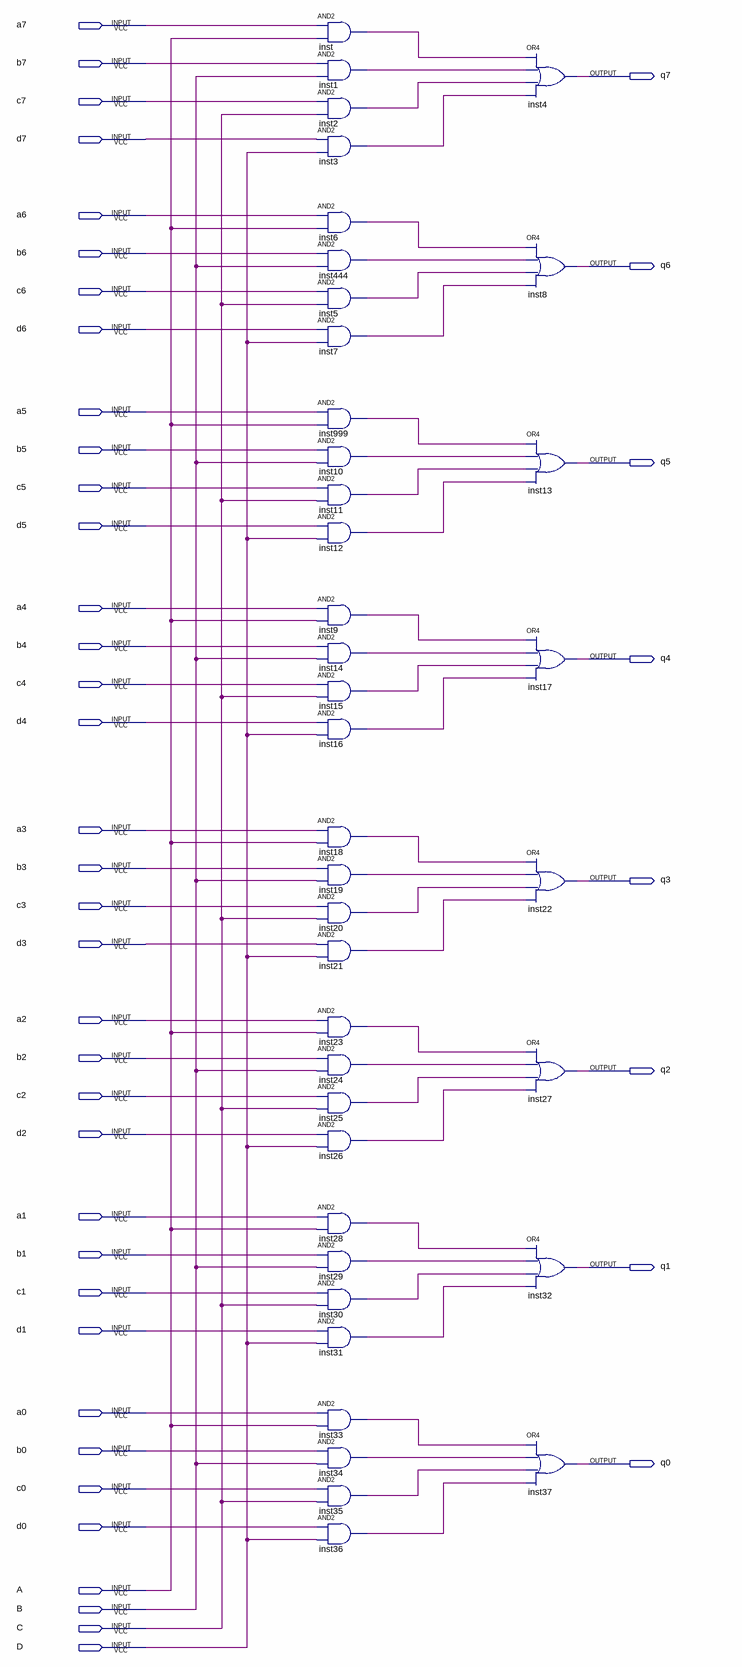
[diagram p0: schematic sheet]
// Quartus schematic choose.bdf as structural Verilog: 40 symbols, 44 pins
module choose (
  input  a7,
  input  b7,
  input  c7,
  input  d7,
  input  a6,
  input  b6,
  input  c6,
  input  d6,
  input  a5,
  input  b5,
  input  c5,
  input  d5,
  input  a4,
  input  b4,
  input  c4,
  input  d4,
  input  a3,
  input  b3,
  input  c3,
  input  d3,
  input  a2,
  input  b2,
  input  c2,
  input  d2,
  input  a1,
  input  b1,
  input  c1,
  input  d1,
  input  a0,
  input  b0,
  input  c0,
  input  d0,
  input  A,
  input  B,
  input  C,
  input  D,
  output q7,
  output q6,
  output q5,
  output q4,
  output q3,
  output q2,
  output q1,
  output q0
);

  wire inst1_out, inst2_out, inst3_out, inst5_out, inst6_out, inst7_out, inst9_out, inst10_out, inst11_out,
       inst12_out, inst14_out, inst15_out, inst16_out, inst18_out, inst19_out, inst20_out, inst21_out,
       inst23_out, inst24_out, inst25_out, inst26_out, inst28_out, inst29_out, inst30_out, inst31_out,
       inst33_out, inst34_out, inst35_out, inst36_out, inst444_out, inst999_out, inst_out;

  and inst (inst_out, a7, A);
  and inst1 (inst1_out, b7, B);
  and inst2 (inst2_out, c7, C);
  and inst3 (inst3_out, d7, D);
  and inst6 (inst6_out, a6, A);
  and inst444 (inst444_out, b6, B);
  and inst5 (inst5_out, c6, C);
  and inst7 (inst7_out, d6, D);
  and inst999 (inst999_out, a5, A);
  and inst10 (inst10_out, b5, B);
  and inst11 (inst11_out, c5, C);
  and inst12 (inst12_out, d5, D);
  and inst9 (inst9_out, a4, A);
  and inst14 (inst14_out, b4, B);
  and inst15 (inst15_out, c4, C);
  and inst16 (inst16_out, d4, D);
  and inst18 (inst18_out, a3, A);
  and inst19 (inst19_out, b3, B);
  and inst20 (inst20_out, c3, C);
  and inst21 (inst21_out, d3, D);
  and inst23 (inst23_out, a2, A);
  and inst24 (inst24_out, b2, B);
  and inst25 (inst25_out, c2, C);
  and inst26 (inst26_out, d2, D);
  and inst28 (inst28_out, a1, A);
  and inst29 (inst29_out, b1, B);
  and inst30 (inst30_out, c1, C);
  and inst31 (inst31_out, d1, D);
  and inst33 (inst33_out, a0, A);
  and inst34 (inst34_out, b0, B);
  and inst35 (inst35_out, c0, C);
  and inst36 (inst36_out, d0, D);
  or inst4 (q7, inst_out, inst1_out, inst2_out, inst3_out);
  or inst8 (q6, inst6_out, inst444_out, inst5_out, inst7_out);
  or inst13 (q5, inst999_out, inst10_out, inst11_out, inst12_out);
  or inst17 (q4, inst9_out, inst14_out, inst15_out, inst16_out);
  or inst22 (q3, inst18_out, inst19_out, inst20_out, inst21_out);
  or inst27 (q2, inst23_out, inst24_out, inst25_out, inst26_out);
  or inst32 (q1, inst28_out, inst29_out, inst30_out, inst31_out);
  or inst37 (q0, inst33_out, inst34_out, inst35_out, inst36_out);
endmodule
